# EAGLE schematic LoRa-E5 mini v1.0 (EAGLE 6.4)
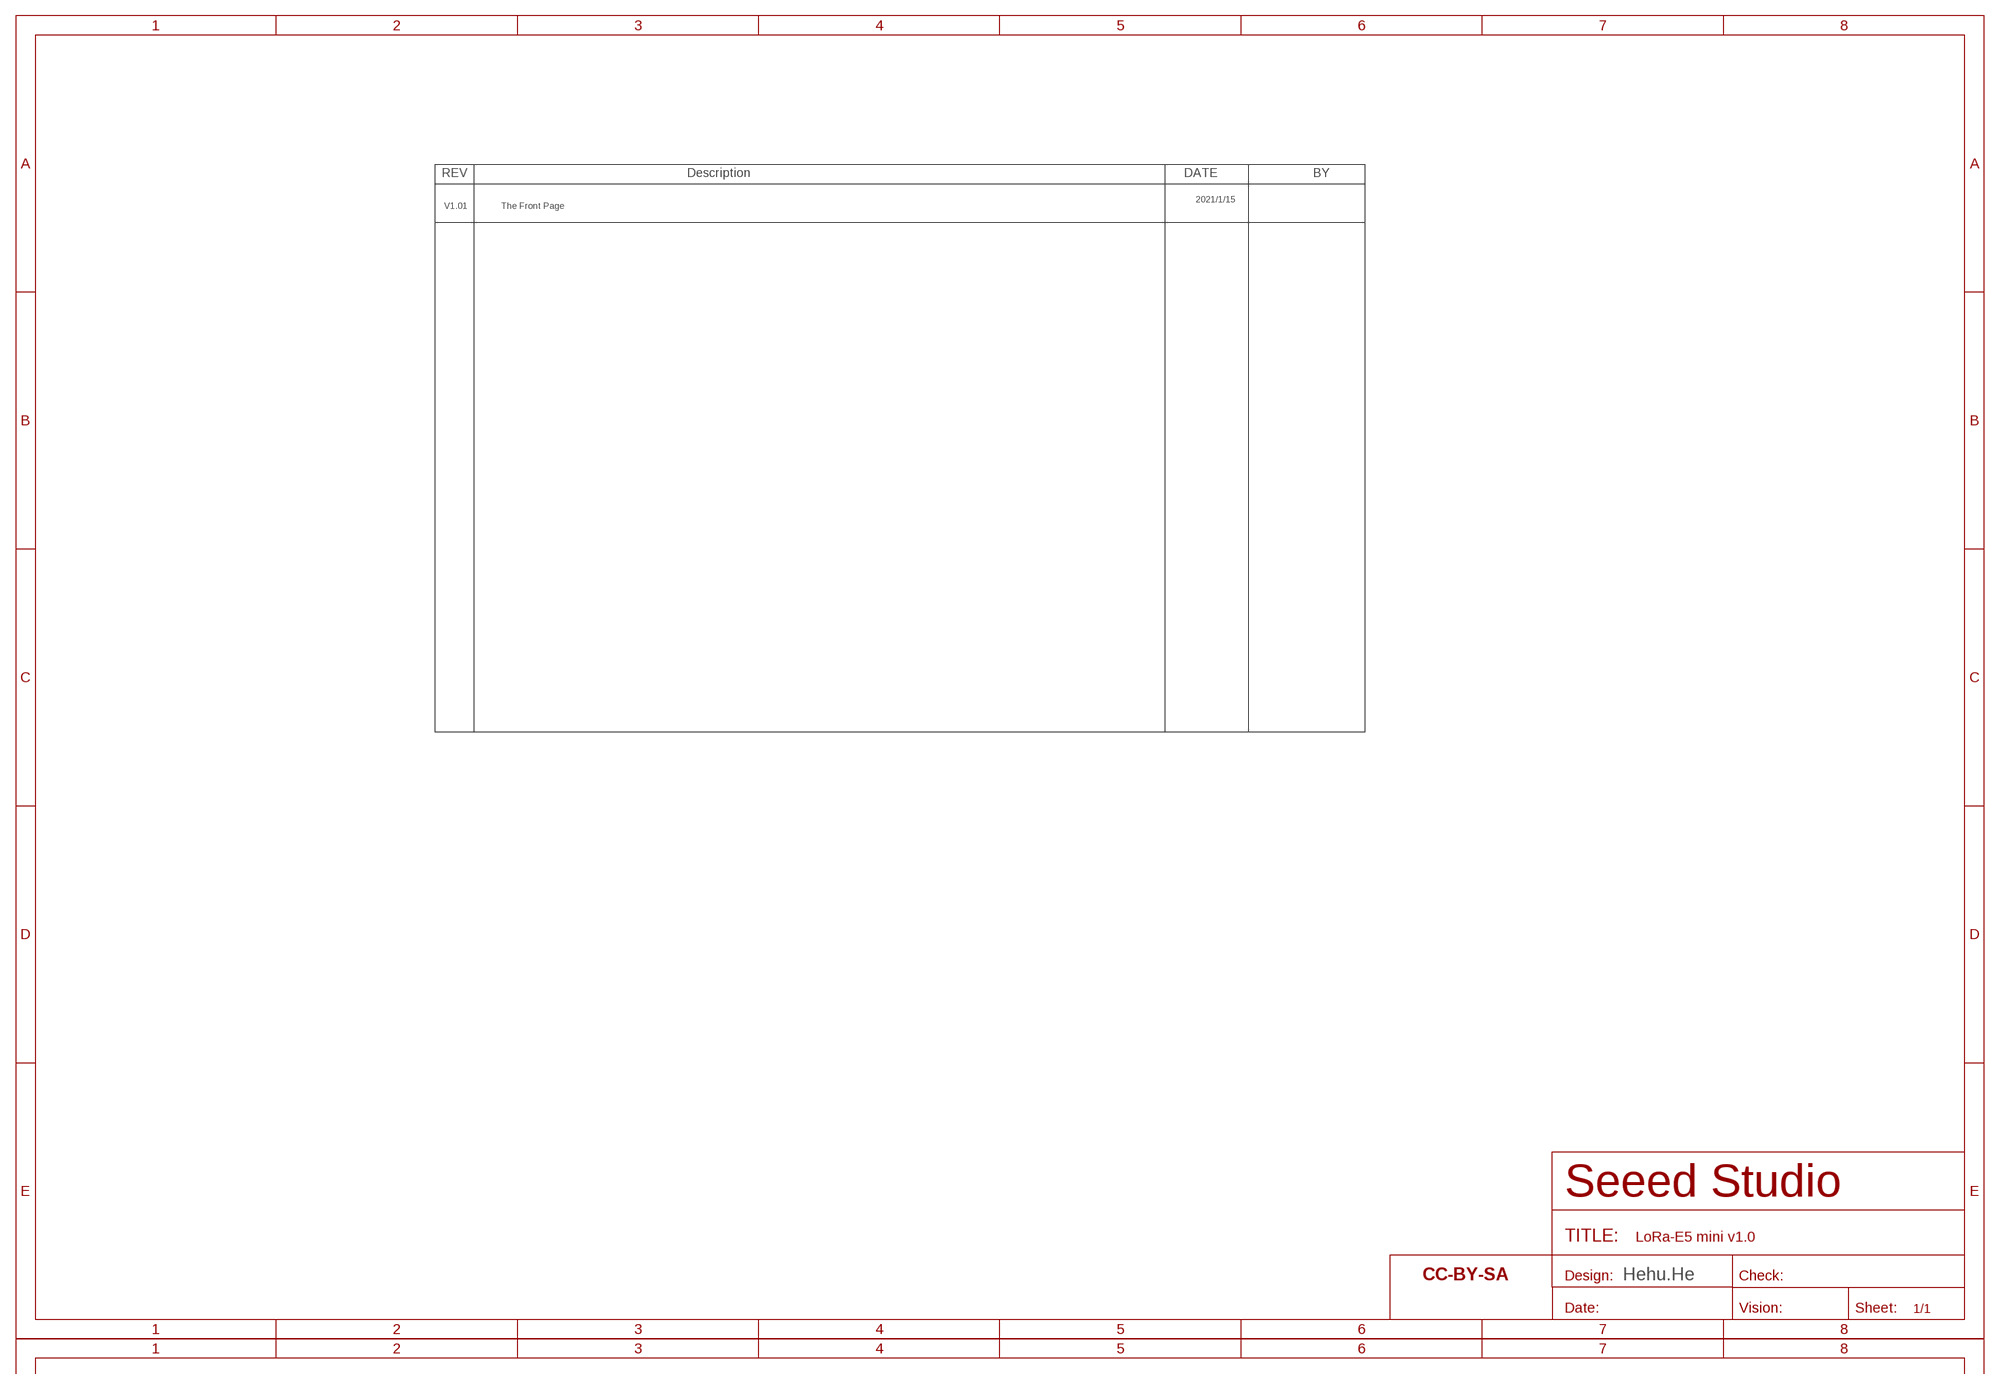
[diagram p0: schematic, sheet 1, part 1 of 2]
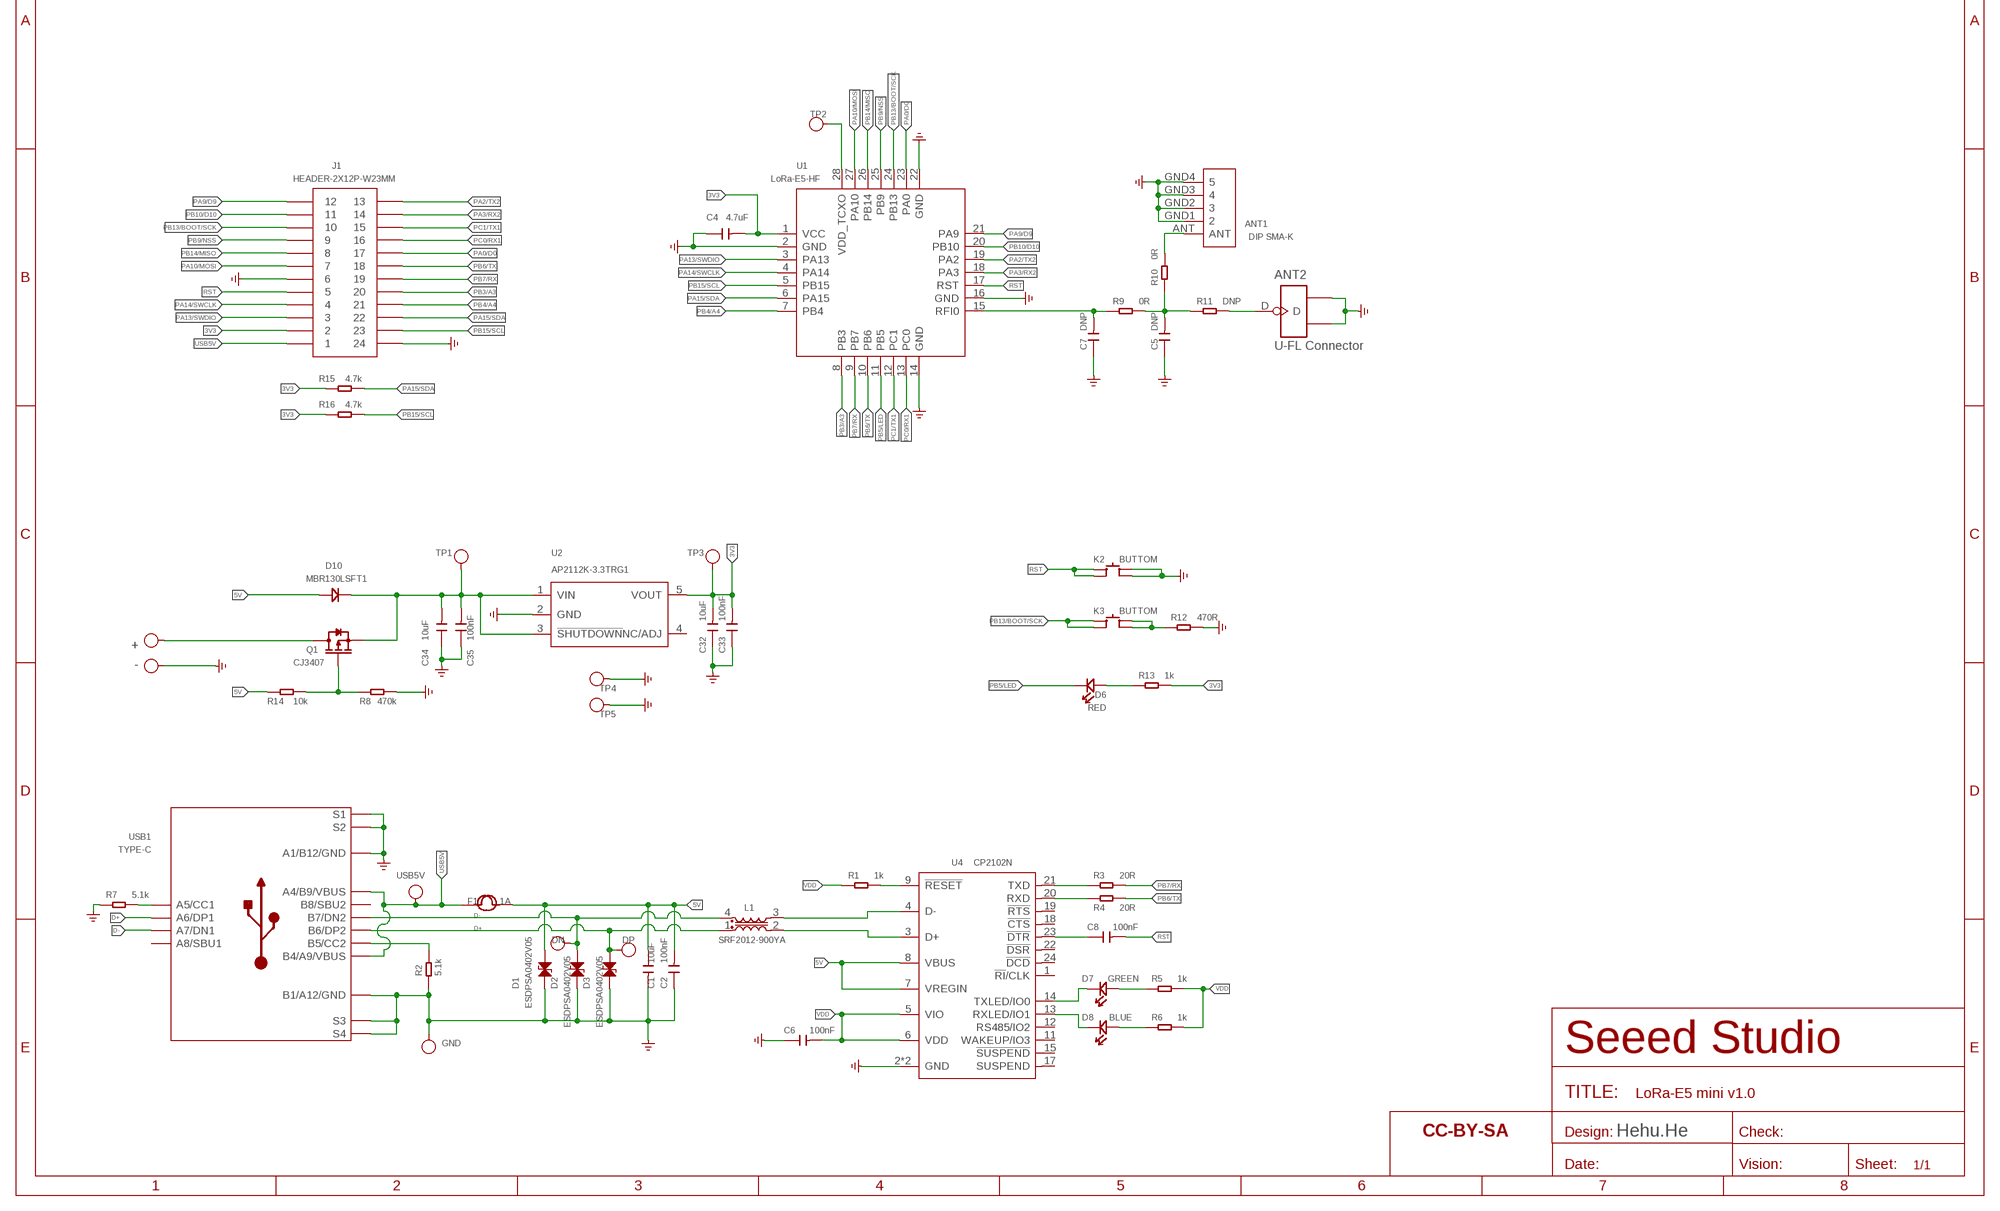
[diagram p1: schematic, sheet 1, part 2 of 2]

## Parts
+  TEST-POINT-D65/35  [TP-D65/35MIL]
-  TEST-POINT-D65/35  [TP-D65/35MIL]
ANT1  DIP SMA-K  ANTENNA-SMA-MCX-JE-320160125  [SMA5P-SMD-5.1-6.5X6.5X16.5MM]
ANT2  U-FL Connector  ANTENNA-U-FL-320110048  [U-FL3P-SMD-2.6X2.6X1.0MM]
C1  10uF  CAP-0603  [C0603]
C2  100nF  CAP-0402  [C0402]
C4  4.7uF  CAP-0603  [C0603]
C5  DNP  CAP-0402  [C0402]
C6  100nF  CAP-0402  [C0402]
C7  DNP  CAP-0402  [C0402]
C8  100nF  CAP-0402  [C0402]
C32  10uF  CAP-0805  [C0805]
C33  100nF  CAP-0603  [C0603]
C34  10uF  CAP-0805  [C0805]
C35  100nF  CAP-0603  [C0603]
D1  ESDPSA0402V05  D-ESD-2P-DOUBLE-0402  [ESD-0402]
D2  ESDPSA0402V05  D-ESD-2P-DOUBLE-0402  [ESD-0402]
D3  ESDPSA0402V05  D-ESD-2P-DOUBLE-0402  [ESD-0402]
D6  RED  LED'0603'  [LED-0603]
D7  GREEN  LED'0603'  [LED-0603]
D8  BLUE  LED'0603'  [LED-0603]
D10  MBR130LSFT1  DIODE'1206'  [SOD-123]
DN  TEST  TEST-POINT'4545'  [TP-D45MIL]
DP  TEST  TEST-POINT'4545'  [TP-D45MIL]
F1  1A  FUSE'1206'  [F1206]
GND  TEST  TEST-POINT'4545'  [TP-D45MIL]
J1  HEADER-2X12P-W23MM  [H2X12-2.54-23MM]
K2  BUTTOM  BUTTON-4P-4.5X3.2  [SW4P-SMD-4.5X3.2X2.5MM]
K3  BUTTOM  BUTTON-4P-4.5X3.2  [SW4P-SMD-4.5X3.2X2.5MM]
L1  SRF2012-900YA  INDUCTOR-COMMON-MODE-SRF2012-900YA  [INT4-0.85-2X1.25X1.2MM]
Q1  CJ3407  MOSFET-P'SI2323CDS/SI2305DS<BR>'  [SOT-23]
R1  1k  RES-0402  [R0402]
R2  5.1k  RES-0402  [R0402]
R3  20R  RES-0402  [R0402]
R4  20R  RES-0402  [R0402]
R5  1k  RES-0402  [R0402]
R6  1k  RES-0402  [R0402]
R7  5.1k  RES-0402  [R0402]
R8  470k  RES-0402  [R0402]
R9  0R  RES-0402  [R0402]
R10  0R  RES-0402  [R0402]
R11  DNP  RES-0402  [R0402]
R12  470R  RES-0402  [R0402]
R13  1k  RES-0402  [R0402]
R14  10k  RES-0402  [R0402]
R15  4.7k  RES-0402  [R0402]
R16  4.7k  RES-0402  [R0402]
TP1  TEST  TEST-POINT'4545'  [TP-D45MIL]
TP2  TEST  TEST-POINT'4545'  [TP-D45MIL]
TP3  TEST  TEST-POINT'4545'  [TP-D45MIL]
TP4  TEST-POINT-23  [TP-D23MIL]
TP5  TEST-POINT-23  [TP-D23MIL]
U1  LoRa-E5-HF  MOUDLE_LORA_E5  [MOUDLE28P-1.25-12X12X2.5MM]
U2  AP2112K-3.3TRG1  PMIC-AP2127  [SOT-23-5]
U4  CP2102N  CONVERTER-CP2102N(QFN24)  [QFN24G-0.5-4X4MM]
USB1  TYPE-C  USB2.0-TYPE-C-320010698  [USB2.0-TYPE-C]
USB5V  TEST  TEST-POINT'4545'  [TP-D45MIL]

## Nets
3V3: C4.2 C32.2 C33.2 J1.A2 J1.B2 J1.E2 J1.F2 R13.2 R15.1 R16.1 TP3.T U1.1(VCC) U2.5(VOUT)
5V: C1.1 C2.2 D1.2 D10.+ F1.2 R14.1 U4.7(VREGIN) U4.8(VBUS)
D+: D3.2 DP.T L1.1 USB1.A6(A6/DP1) USB1.B6(B6/DP2)
D-: D2.2 DN.T L1.4 USB1.A7(A7/DN1) USB1.B7(B7/DN2)
GND: -.P1(T) ANT1.GND1 ANT1.GND2 ANT1.GND3 ANT1.GND4 ANT2.GND1 ANT2.GND2 C1.2 C2.1 C4.1 C5.1 C6.1 C7.1 C32.1 C33.1 C34.1 C35.1 D1.1 D2.1 D3.1 GND.T J1.A6 J1.B6 J1.C12 J1.D12 J1.E6 J1.E24 J1.F6 J1.F24 K2.3(B0) K2.4(B1) R2.1 R7.1 R8.1 R12.2 TP4.T TP5.T U1.2(GND) U1.14(GND) U1.16(GND) U1.22(GND) U2.2(GND) U4.2(GND) U4.PAD(GND) USB1.A1_B12(A1/B12/GND) USB1.B1_A12(B1/A12/GND) USB1.S1 USB1.S2 USB1.S3 USB1.S4 USB1.S5(S1) USB1.S6(S2) ; supply symbol labelled GND_POWER
N$2: R2.2 USB1.B5(B5/CC2)
N$3: Q1.1(G) R8.2 R14.2
N$4: ANT2.D R11.2
N$5: C8.1 U4.23(!DTR!)
N$6: D7.- U4.14(TXLED/IO0)
N$7: D8.- U4.13(RXLED/IO1)
N$8: D7.+ R5.1
N$9: D8.+ R6.1
N$10: R3.1 U4.21(TXD)
N$11: R4.1 U4.20(RXD)
N$12: D6.+ R13.1
N$13: ANT1.ANT R10.2
N$14: C34.2 C35.2 D10.- Q1.2(S) TP1.T U2.1(VIN) U2.3(!SHUTDOWN)
N$15: +.P1(T) Q1.3(D)
N$19: TP2.T U1.28(VDD_TCXO)
N$23: L1.3 U4.4(D-)
N$25: R1.2 U4.9(!RESET!)
N$26: L1.2 U4.3(D+)
N$27: R7.2 USB1.A5(A5/CC1)
N$28: C5.2 R9.2 R10.1 R11.1
N$29: K3.3(B0) K3.4(B1) R12.1
PA0/D0: J1.C5 J1.D5 J1.E17 J1.F17 U1.23(PA0)
PA2/TX2: J1.C1 J1.D1 J1.E13 J1.F13 U1.19(PA2)
PA3/RX2: J1.C2 J1.D2 J1.E14 J1.F14 U1.18(PA3)
PA9/D9: J1.A12 J1.B12 J1.E12 J1.F12 U1.21(PA9)
PA10/MOSI: J1.A7 J1.B7 J1.E7 J1.F7 U1.27(PA10)
PA13/SWDIO: J1.A3 J1.B3 J1.E3 J1.F3 U1.3(PA13)
PA14/SWCLK: J1.A4 J1.B4 J1.E4 J1.F4 U1.4(PA14)
PA15/SDA: J1.C10 J1.D10 J1.E22 J1.F22 R15.2 U1.6(PA15)
PB3/A3: J1.C8 J1.D8 J1.E20 J1.F20 U1.8(PB3)
PB4/A4: J1.C9 J1.D9 J1.E21 J1.F21 U1.7(PB4)
PB5/LED: D6.- U1.11(PB5)
PB6/TX: J1.C6 J1.D6 J1.E18 J1.F18 R4.2 U1.10(PB6)
PB7/RX: J1.C7 J1.D7 J1.E19 J1.F19 R3.2 U1.9(PB7)
PB9/NSS: J1.A9 J1.B9 J1.E9 J1.F9 U1.25(PB9)
PB10/D10: J1.A11 J1.B11 J1.E11 J1.F11 U1.20(PB10)
PB13/BOOT/SCK: J1.A10 J1.B10 J1.E10 J1.F10 K3.1(A0) K3.2(A1) U1.24(PB13)
PB14/MISO: J1.A8 J1.B8 J1.E8 J1.F8 U1.26(PB14)
PB15/SCL: J1.C11 J1.D11 J1.E23 J1.F23 R16.2 U1.5(PB15)
PC0/RX1: J1.C4 J1.D4 J1.E16 J1.F16 U1.13(PC0)
PC1/TX1: J1.C3 J1.D3 J1.E15 J1.F15 U1.12(PC1)
RF: C7.2 R9.1 U1.15(RFI0)
RST: C8.2 J1.A5 J1.B5 J1.E5 J1.F5 K2.1(A0) K2.2(A1) U1.17(RST)
USB5V: F1.1 J1.A1 J1.B1 J1.E1 J1.F1 USB1.A4_B9(A4/B9/VBUS) USB1.B4_A9(B4/A9/VBUS) USB5V.T
VDD: C6.2 R1.1 R5.2 R6.2 U4.5(VIO) U4.6(VDD)
Unconnected: U2.4(NC/ADJ) U4.1(!RI!/CLK) U4.11(WAKEUP/IO3) U4.12(RS485/IO2) U4.15(!SUSPEND!) U4.17(SUSPEND) U4.18(!CTS!) U4.19(!RTS!) U4.22(!DSR!) U4.24(!DCD!) USB1.A8(A8/SBU1) USB1.B8(B8/SBU2)

## Notes on the sheet
- 2021/1/15
- V1.01 | The Front Page
- Hehu.He
- +
- -
- Hehu.He

## Library data of the parts
+ - TP4 TP5 = Discrete-new:TEST-POINT
ANT1 = Connector-new:ANTENNA-SMA-MCX-JE
ANT2 = Connector-new:ANTENNA-U-FL
C1 C2 C4-C8 C32-C35 = Discrete-new:CAP: Ceramic Capacitors
D1-D3 = Discrete-new:D-ESD-2P-DOUBLE
D6-D8 = Discrete-new:LED
D10 = Discrete-new:DIODE
DN DP GND TP1-TP3 USB5V = Discrete-new:TEST-POINT; PARTNO: DNP
F1 = Discrete-new:FUSE
J1 = Connector-new:HEADER-2X12P-W23MM
K2 K3 = Switch:BUTTON-4P
L1 = Discrete-new:INDUCTOR-COMMON-MODE
Q1 = Discrete-new:MOSFET-P
R1-R16 = Discrete-new:RES
U1 = moudle-new:MOUDLE_LORA_E5
U2 = PMIC:PMIC-AP2127
U4 = IC-new:CONVERTER-CP2102N(QFN24)
USB1 = Connector-new:USB2.0-TYPE-C